# EAGLE design sine wave inverter 1kw(2) (EAGLE 9.6.2)
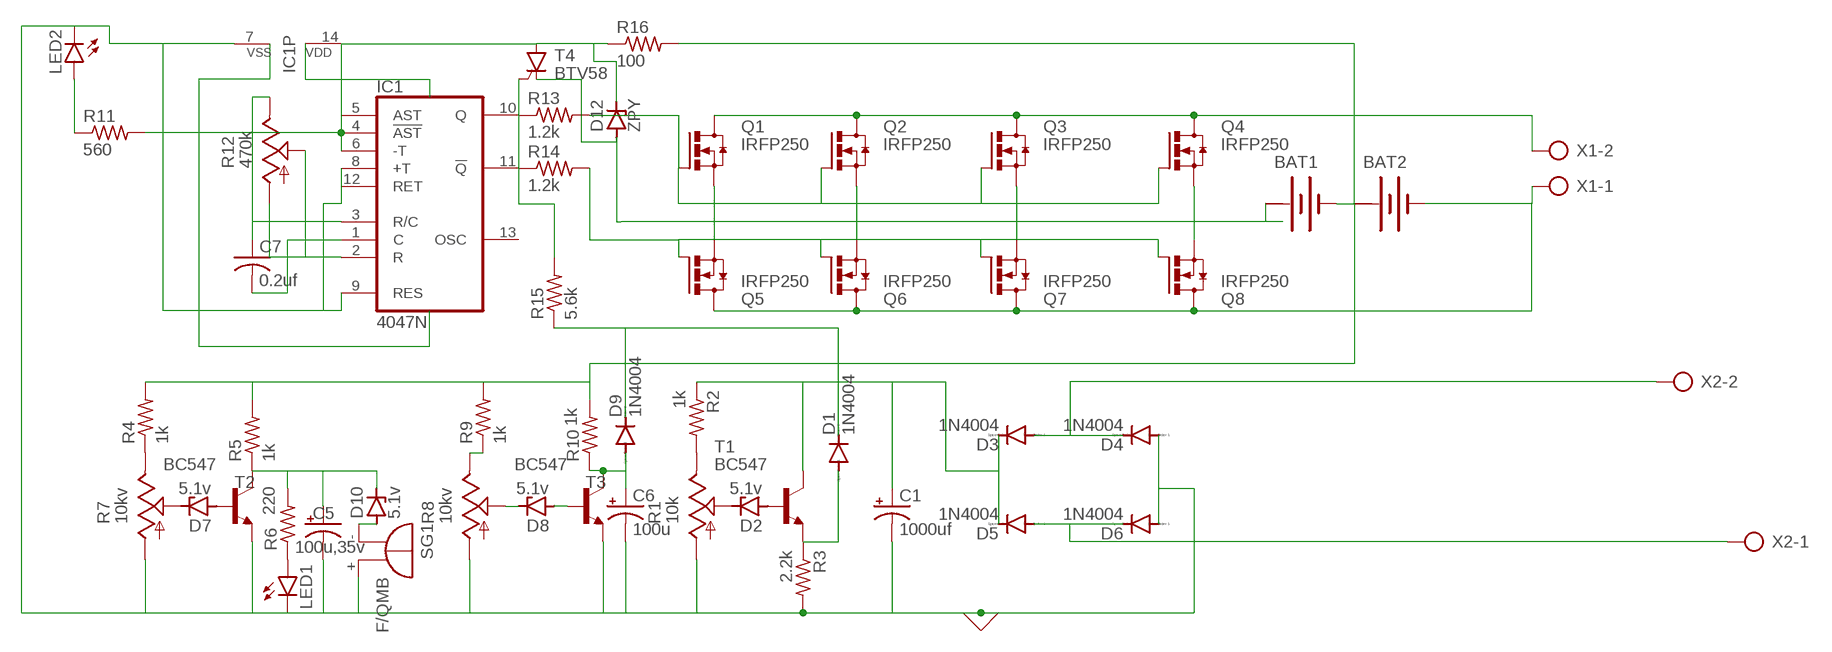
[diagram p0: schematic, sheet 1]

## Parts
BAT1  BATTERY  [BATTERY]
BAT2  BATTERY  [BATTERY]
C1  1000uf  CPOL-USE3.5-10  [E3,5-10]
C5  100u,35v  CPOL-USE3.5-10  [E3,5-10]
C6  100u  CPOL-USE3.5-10  [E3,5-10]
C7  0.2uf  C-US025-024X044  [C025-024X044]
D1  1N4004  [DO41-10]
D2  5.1v  BZX84CSMD  [TO236]
D3  1N4004  [DO41-10]
D4  1N4004  [DO41-10]
D5  1N4004  [DO41-10]
D6  1N4004  [DO41-10]
D7  5.1v  BZX84CSMD  [TO236]
D8  5.1v  BZX84CSMD  [TO236]
D9  1N4004  [DO41-10]
D10  5.1v  BZX84CSMD  [TO236]
D12  ZPY  [DO41Z10]
IC1  4047N  [DIL14]
LED1  LED5MM  [LED5MM]
LED2  LED5MM  [LED5MM]
Q1  IRFP250  [TO-247AD-V]
Q2  IRFP250  [TO-247AD-V]
Q3  IRFP250  [TO-247AD-V]
Q4  IRFP250  [TO-247AD-V]
Q5  IRFP250  [TO-247AD-V]
Q6  IRFP250  [TO-247AD-V]
Q7  IRFP250  [TO-247AD-V]
Q8  IRFP250  [TO-247AD-V]
R1  10k  TRIM_US-B25P  [B25P]
R2  1k  R-US_M1206  [M1206]
R3  2.2k  R-US_M1206  [M1206]
R4  1k  R-US_M1206  [M1206]
R5  1k  R-US_M1206  [M1206]
R6  220  R-US_M1206  [M1206]
R7  10kv  TRIM_US-B25P  [B25P]
R8  10kv  TRIM_US-B25P  [B25P]
R9  1k  R-US_M1206  [M1206]
R10  1k  R-US_M1206  [M1206]
R11  560  R-US_M1206  [M1206]
R12  470k  TRIM_US-B25P  [B25P]
R13  1.2k  R-US_M1206  [M1206]
R14  1.2k  R-US_M1206  [M1206]
R15  5.6k  R-US_M1206  [M1206]
R16  100  R-US_M1206  [M1206]
SG1  F/QMB  [F/QMB]
T1  BC547  [TO92]
T2  BC547  [TO92]
T3  BC547  [TO92]
T4  BTV58  [TO220CS]
X1  AK300/2  [AK300/2]
X2  AK300/2  [AK300/2]

## Nets
0: C1.- C5.- C6.- D4.A D6.A IC1.7(VSS) IC1.8(+T) IC1.9(RES) IC1.12(RET) LED1.K(C) LED2.K(C) R1.A R3.2 R7.A R8.A SG1.+(-) T2.1(E) T3.1(E) ; supply symbol labelled GND
N$1: D2.C R1.S
N$2: R1.E R2.2
N$3: D2.A T1.2(B)
N$4: D1.A R3.1 T1.1(E)
N$5: C1.+ D3.C D5.C R2.1 T1.3(C)
N$6: BAT1.- BAT2.+ R4.2 R5.2 R9.2 R10.2 R16.2
N$7: Q1.G Q2.G Q3.G Q4.G R13.2
N$8: D3.A D4.C X2.2
N$9: Q1.S Q5.S
N$10: D5.A D6.C X2.1
N$11: D7.C R7.S
N$12: Q2.S Q6.S
N$13: Q3.S Q7.S
N$14: Q4.S Q8.S
N$15: Q5.G Q6.G Q7.G Q8.G R14.2
N$17: BAT2.- Q5.D Q6.D Q7.D Q8.D X1.1
N$18: Q1.D Q2.D Q3.D Q4.D X1.2
N$20: D7.A T2.2(B)
N$21: BAT1.+ D12.A T4.C
N$23: C5.+ D10.C R5.1 R6.2 T2.3(C)
N$24: R4.1 R7.E
N$25: LED1.A R6.1
N$26: D1.C D9.C R15.1
N$28: R8.E R9.1
N$29: D8.C R8.S
N$30: D8.A T3.2(B)
N$31: C6.+ D9.A R10.1 T3.3(C)
N$32: D10.A SG1.-(+)
N$33: C7.2 IC1.1(C)
N$35: IC1.2(R) R12.A R12.S
N$36: C7.1 IC1.3(R/C) R12.E
N$37: D12.C IC1.4(!AST) IC1.5(AST) IC1.6(-T) IC1.14(VDD) R11.2 R16.1 T4.A
N$39: IC1.10(Q) R13.1
N$40: IC1.11(!Q) R14.1
N$41: LED2.A R11.1
N$42: R15.2 T4.G
Unconnected: IC1.13(OSC)

## Power pins joined to a net without a drawn wire
+: BAT1.+@1(+) BAT2.+@1(+)

## Library data of the parts
BAT1 BAT2 = special:BATTERY: BATTERY
C1 C5 C6 = rcl:CPOL-US: POLARIZED CAPACITOR, American symbol; SPICEPREFIX: C
C7 = rcl:C-US: CAPACITOR, American symbol; SPICEPREFIX: C
D1 D3-D6 D9 = diode:1N4004: DIODE general purpose rectifier, 1 A
D2 D7 D8 D10 = diode:BZX84CSMD: Z DIODE
D12 = diode:ZPY: Z DIODE 1 W
IC1 = 40xx:4047: LP monostable/astable MULTIVIBRATOR
LED1 LED2 = led:LED: LED OSRAM: - CHIPLED LG R971, LG N971, LY N971, LG Q971, LY Q971, LO R971, LY R971 LH N974, LH R974 LS Q976, LO Q976, LY Q976 LO Q996 - Hyper CHIPLED LW Q18S LB Q993, LB Q99A, LB R99A - SideLED LS A670, LO A670, LY A670, LG A670, LP A670 LB A673, LV A673, LT A673, LW A673 LH A674 LY A675 LS A676, LA A676, LO A676, LY A676, LW A676 LS A679, LY A679, LG A679 - Hyper Micro SIDELED® LS Y876, LA Y876, LO Y876, LY Y876 LT Y87S - SmartLED LW L88C, LW L88S LB L89C, LB L89S, LG L890 LS L89K, LO L89K, LY L89K LS L896, LA L896, LO L896, LY L896 - TOPLED LS T670, LO T670, LY T670, LG T670, LP T670 LSG T670, LSP T670, LSY T670, LOP T670, LYG T670 LG T671, LOG T671, LSG T671 LB T673, LV T673, LT T673, LW T673 LH T674 LS T676, LA T676, LO T676, LY T676, LB T676, LH T676, LSB T676, LW T676 LB T67C, LV T67C, LT T67C, LS T67K, LO T67K, LY T67K, LW E67C LS E67B, LA E67B, LO E67B, LY E67B, LB E67C, LV E67C, LT E67C LW T67C LS T679, LY T679, LG T679 LS T770, LO T770, LY T770, LG T770, LP T770 LB T773, LV T773, LT T773, LW T773 LH T774 LS E675, LA E675, LY E675, LS T675 LS T776, LA T776, LO T776, LY T776, LB T776 LHGB T686 LT T68C, LB T68C - Hyper Mini TOPLED® LB M676 - Mini TOPLED Santana® LG M470 LS M47K, LO M47K, LY M47K Source: http://www.osram.convergy.de LUXEON: - LUMILED® LXK2-PW12-R00, LXK2-PW12-S00, LXK2-PW14-U00, LXK2-PW14-V00 LXK2-PM12-R00, LXK2-PM12-S00, LXK2-PM14-U00 LXK2-PE12-Q00, LXK2-PE12-R00, LXK2-PE12-S00, LXK2-PE14-T00, LXK2-PE14-U00 LXK2-PB12-K00, LXK2-PB12-L00, LXK2-PB12-M00, LXK2-PB14-N00, LXK2-PB14-P00, LXK2-PB14-Q00 LXK2-PR12-L00, LXK2-PR12-M00, LXK2-PR14-Q00, LXK2-PR14-R00 LXK2-PD12-Q00, LXK2-PD12-R00, LXK2-PD12-S00 LXK2-PH12-R00, LXK2-PH12-S00 LXK2-PL12-P00, LXK2-PL12-Q00, LXK2-PL12-R00 Source: www.luxeon.com KINGBRIGHT: KA-3528ASYC Source: www.kingbright.com
Q1-Q8 = transistor-power:IRFP25*: 33A/27A, 200V/150V, 0.085/0.012 Ohm, N-Channel Power MOSFET Source: Fairchild Semiconductor Corporation
R1 R7 R8 R12 = pot:TRIM_US-: POTENTIOMETER
R2-R6 R9-R11 R13-R16 = rcl:R-US_: RESISTOR, American symbol; SPICEPREFIX: R
SG1 = buzzer:F/QMB: BUZZER Source: Buerklin; OC_FARNELL: unknown; OC_NEWARK: unknown
T1-T3 = transistor:BC547: NPN TRANSISTOR
T4 = triac:BTV58: THYRISTOR
X1 X2 = con-ptr500:AK300/2: CONNECTOR; OC_FARNELL: unknown; OC_NEWARK: unknown

## Board
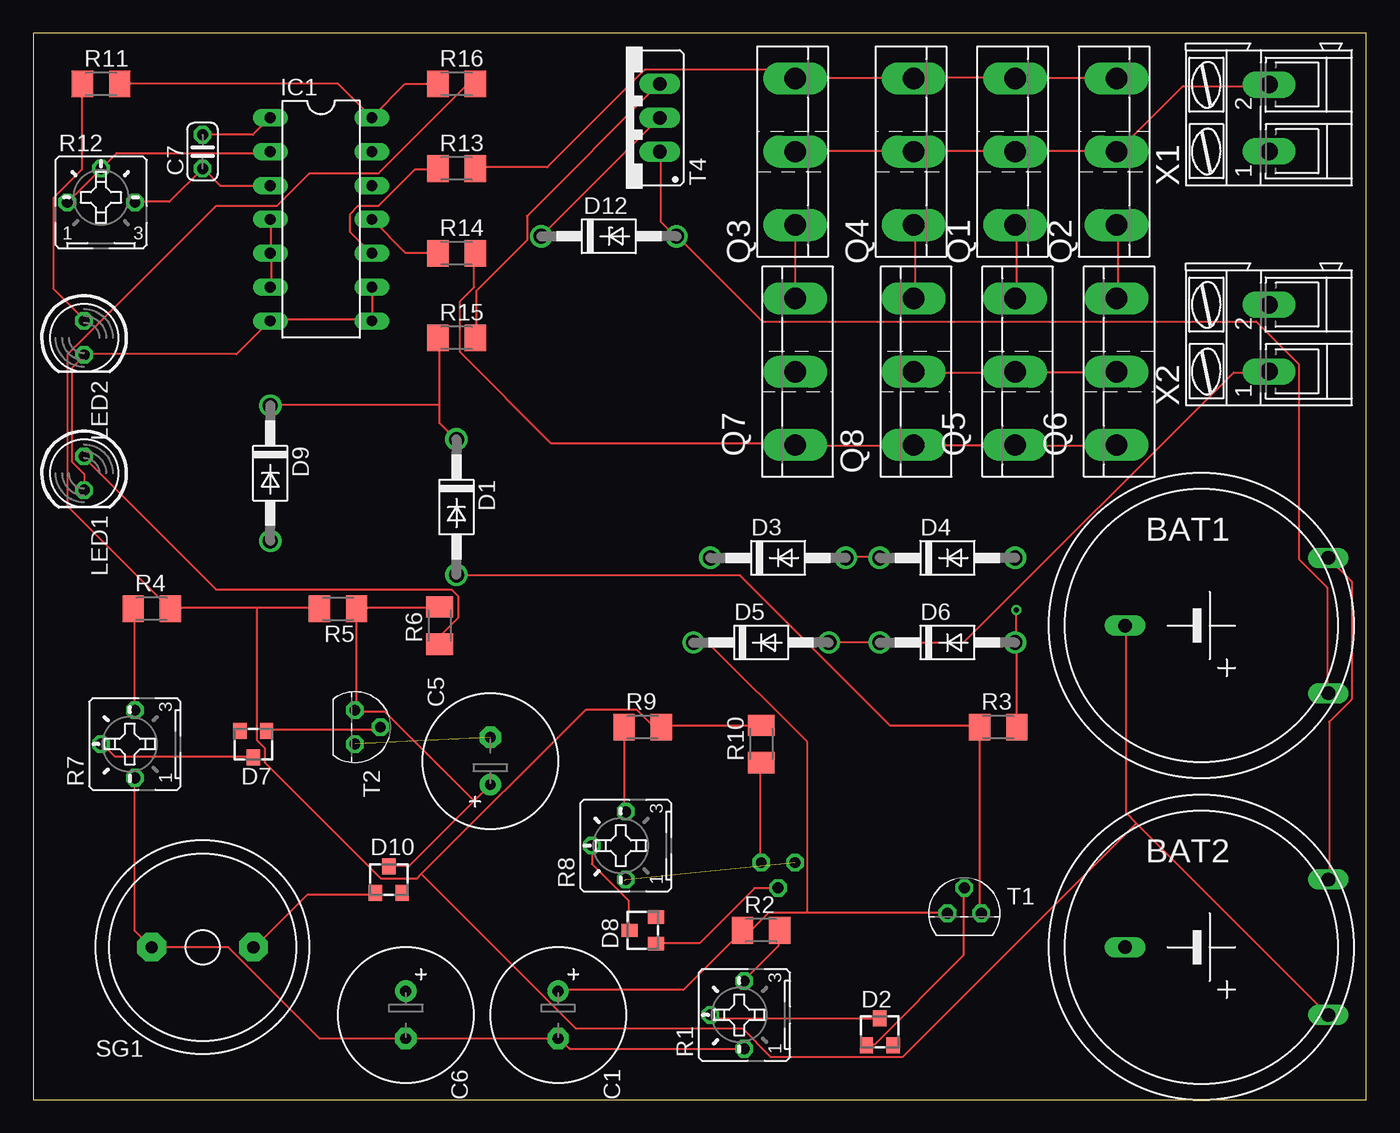
[diagram p1: board, top side]
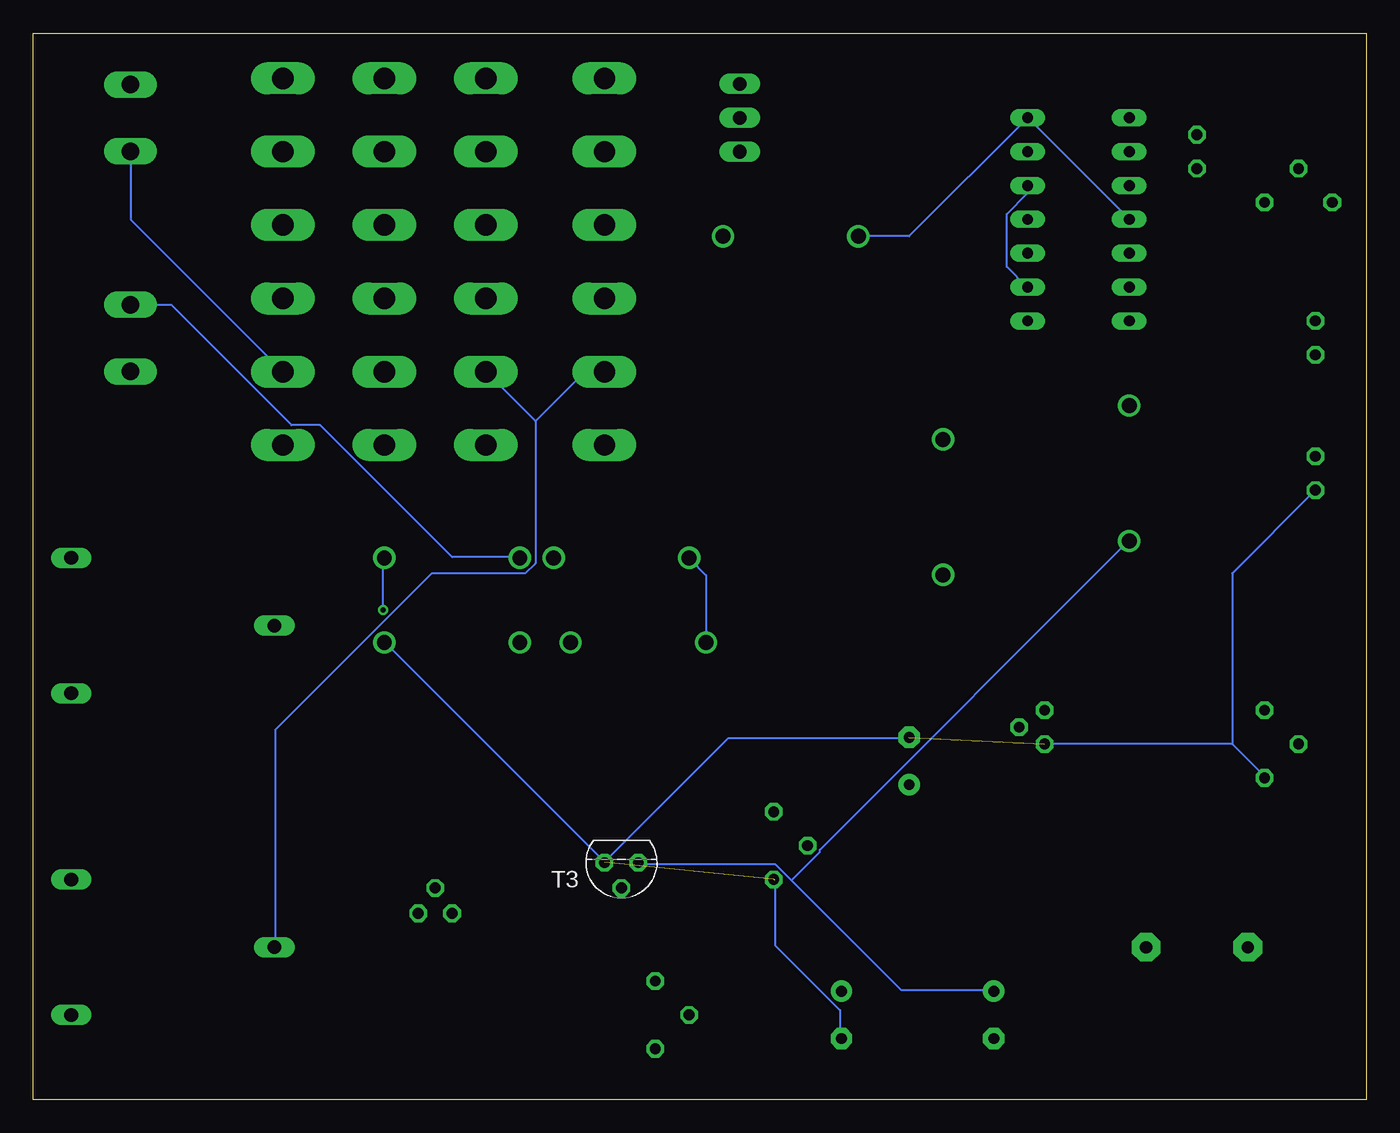
[diagram p2: board, bottom side, seen from below]

Size 100 x 80 mm. Coordinates in mm from the lower left corner, seen from the top.
Outline: 0,0 100,0 100,80 0,80 0,0
Copper layers (1*16): Top 0.035mm / dielectric 1.5mm / Bottom 0.035mm
Design rules "default": minimum track width 6mil, minimum drill 0.35mm, track to track 6mil, track to pad 6mil, pad to pad 6mil, via to via 6mil, smd to smd 6mil, copper to edge 40mil, drill to drill 6mil, minimum pad ring 10mil, minimum via ring 8mil, stop-mask expansion 4mil, vias tented up to drill 0mil, thermal gap 10mil

### Footprints (pad centres in the part's own frame; a part is rotated, then mirrored left to right if it is on the bottom)
BATTERY = drill 1.016 long: + 9.525,-5.08; +@1 9.525,5.08; - -5.715,0
E3,5-10 = drill 0.813 pad 1.6: + -1.778,0 | drill 0.813 pad 1.6 octagon: - 1.778,0
C025-024X044 = drill 0.813 octagon: 1 -1.27,0; 2 1.27,0
DO41-10 = drill 1.118: A 5.08,0; C -5.08,0
TO236 = smd 1 x 1.2: A -1,-1; C 0,1; NC 1,-1
DO41Z10 = drill 1.118: A 5.08,0; C -5.08,0
DIL14 = drill 0.813 long: 1 -7.62,-3.81; 2 -5.08,-3.81; 3 -2.54,-3.81; 4 0,-3.81; 5 2.54,-3.81; 6 5.08,-3.81; 7 7.62,-3.81; 8 7.62,3.81; 9 5.08,3.81; 10 2.54,3.81; 11 0,3.81; 12 -2.54,3.81; 13 -5.08,3.81; 14 -7.62,3.81
LED5MM = drill 0.813 octagon: A -1.27,0; K 1.27,0
TO-247AD-V = drill 1.6 long: D 0,-2.54; G -5.5,-2.54; S 5.5,-2.54
B25P = drill 0.813 octagon: A -2.54,0; E 2.54,0; S 0,2.54
M1206 = smd 1.6 x 2: 1 -1.4,0; 2 1.4,0
F/QMB = drill 0.914 pad 2.159 octagon: + 3.81,0; - -3.81,0
TO92 = drill 0.813 octagon: 1 1.27,0; 2 0,1.905; 3 -1.27,0
TO220CS = drill 1.016 long: A 0,-2.54; C -2.54,-2.54; G 2.54,-2.54
AK300/2 = drill 1.321 long: 1 -2.515,0; 2 2.489,0

### Placement (x,y rotation side)
BAT1  87.63,35.56 0 top
BAT2  87.63,11.43 0 top
C1  39.37,6.35 270 top
C5  34.29,25.4 90 top
C6  27.94,6.35 270 top
C7  12.7,71.12 90 top
D1  31.75,44.45 270 top
D2  63.5,5.08 0 top
D3  55.88,40.64 0 top
D4  68.58,40.64 0 top
D5  54.61,34.29 0 top
D6  68.58,34.29 0 top
D7  16.51,26.67 180 top
D8  45.72,12.7 90 top
D9  17.78,46.99 270 top
D10  26.67,16.51 0 top
D12  43.18,64.77 0 top
IC1  21.59,66.04 270 top
LED1  3.81,46.99 270 top
LED2  3.81,57.15 270 top
Q1  76.2,71.12 270 top
Q2  83.82,71.12 270 top
Q3  59.69,71.12 270 top
Q4  68.58,71.12 270 top
Q5  71.12,54.61 90 top
Q6  78.74,54.61 90 top
Q7  54.61,54.61 90 top
Q8  63.5,54.61 90 top
R1  53.34,6.35 90 top
R2  54.61,12.7 0 top
R3  72.39,27.94 0 top
R4  8.89,36.83 0 top
R5  22.86,36.83 180 top
R6  30.48,35.56 90 top
R7  7.62,26.67 90 top
R8  44.45,19.05 90 top
R9  45.72,27.94 0 top
R10  54.61,26.67 90 top
R11  5.08,76.2 0 top
R12  5.08,67.31 0 top
R13  31.75,69.85 0 top
R14  31.75,63.5 0 top
R15  31.75,57.15 0 top
R16  31.75,76.2 0 top
SG1  12.7,11.43 180 top
T1  69.85,13.97 0 top
T2  24.13,27.94 270 top
T3  55.88,17.78 180 bottom
T4  44.45,73.66 90 top
X1  92.71,73.66 90 top
X2  92.71,57.15 90 top

### Tracks (layer width: path | path; a pad name or v marks a point on that pad's centre or on a via)
0  (via drill 0.35)  (3 unrouted)
  Top 0.152: R7.A 7.62,12.65 8.84,11.43 SG1.+ 14.63,11.43 21.49,4.57 C6.- C1.- 39.47,4.57 40.23,3.81 R1.A | LED1.K 3.81,46.94 2.9,47.85 2.9,54.86 3.81,55.78 LED2.K 3.81,55.93 15.24,55.93 17.68,58.37 IC1.7 17.83,58.52 25.3,58.52 IC1.8 25.45,58.52 25.45,60.96 IC1.9 | 73.76,34.29 73.76,28.04 R3.2 | 73.76,34.29 v73.76,36.73 | 73.76,34.29 D6.A
  Bottom 0.152: 10.06,26.67 T2.1 | 10.06,26.67 7.62,24.23 R7.A | IC1.12 25.45,68.58 25.45,67.97 26.98,66.45 26.98,62.48 25.45,60.96 IC1.9 | 10.06,26.67 10.06,39.47 LED1.K | v73.76,36.73 73.76,40.54 D4.A | C5.- 34.29,27.13 47.85,27.13 57.15,17.83 73.61,34.29 D6.A | 44.35,16.46 44.35,11.58 39.47,6.71 39.47,4.57 C1.-
+
  Top 0.152: BAT2.+@1 97.23,16.61 97.23,28.35 98.91,30.02 98.91,38.86 97.23,40.54 BAT1.+@1
N$1
  Top 0.152: R1.S 51.05,6.1 63.4,6.1 D2.C
N$2
  Top 0.152: R2.2 55.93,12.65 55.93,11.58 53.34,8.99 R1.E
N$3
  Top 0.152: D2.A 62.64,4.12 63.09,4.12 69.8,10.82 69.8,15.85 T1.2
N$4
  Top 0.152: T1.1 71.02,14.02 71.02,27.89 R3.1 70.87,28.04 64.31,28.04 53.03,39.32 31.85,39.32 D1.A
N$5
  Top 0.152: 58.06,14.02 68.58,14.02 T1.3 | 58.06,14.02 55.17,14.02 53.95,12.8 53.34,12.8 R2.1 53.19,12.65 48.77,8.23 39.47,8.23 C1.+ | D5.C 50.6,34.29 58.06,26.82 58.06,14.02
  Bottom 0.152: D5.C 49.53,39.32 50.75,40.54 D3.C
N$6
  Top 0.152: 82.75,20.73 97.08,6.4 BAT2.+ | 82.75,20.73 81.99,21.49 81.99,35.51 BAT1.- | R10.2 54.56,28.04 47.24,28.04 R9.2 47.09,28.04 46.48,28.04 45.26,29.26 41.45,29.26 29.11,16.92 | 16.76,36.88 21.34,36.88 R5.2 | 16.76,36.88 10.36,36.88 R4.2 10.21,36.88 2.59,44.5 2.59,55.93 13.72,67.06 18.29,67.06 20.73,69.49 25.91,69.49 32.61,76.2 R16.2 | 29.11,16.92 28.8,16.61 26.06,16.61 17.37,25.3 17.37,26.36 16.76,26.98 16.76,36.88 | 82.75,20.73 65.23,3.2 55.32,3.2 53.19,5.33 40.69,5.33 29.11,16.92
N$7
  Top 0.152: Q2.G 81.23,76.66 73.76,76.66 Q1.G 73.61,76.66 66.14,76.66 Q4.G 65.99,76.66 57.15,76.66 | 57.15,76.66 56.54,77.27 45.87,77.27 38.56,69.95 33.22,69.95 R13.2 | 57.15,76.66 Q3.G
N$8
  Top 0.152: D3.A 60.96,40.69 63.4,40.69 D4.C
  Bottom 0.152: X2.2 92.66,59.59 89.61,59.59 80.62,50.6 78.49,50.6 68.58,40.69 63.55,40.69 D4.C
N$9
  Top 0.152: Q5.S 73.76,60.2 73.76,65.53 Q1.S
N$10
  Top 0.152: D5.A D6.C 69.8,34.29 90.07,54.56 92.66,54.56 X2.1
N$11
  Top 0.152: D7.C 16.46,25.76 6.1,25.76 5.18,26.67 R7.S
N$12
  Top 0.152: Q6.S 81.38,60.2 81.38,65.53 Q2.S
N$13
  Top 0.152: Q3.S Q7.S
N$14
  Top 0.152: Q8.S 66.14,60.2 66.14,65.53 Q4.S
N$15
  Top 0.152: Q6.G 81.23,49.07 73.76,49.07 Q5.G 73.61,49.07 66.14,49.07 Q8.G 65.99,49.07 57.15,49.07 Q7.G 57.15,49.23 38.86,49.23 32,56.08 32,59.89 33.07,60.96 33.07,63.4 R14.2
N$17
  Top 0.152: Q6.D 81.23,54.56 73.76,54.56 Q5.D 73.61,54.56 66.14,54.56 Q8.D
  Bottom 0.152: Q6.D 92.66,65.99 92.66,71.02 X1.1 | 62.33,50.9 62.33,40.23 63.09,39.47 70.1,39.47 81.84,27.74 81.84,11.43 BAT2.- | Q8.D 62.33,50.9 | 62.33,50.9 58.67,54.56 57.15,54.56 Q7.D
N$18
  Top 0.152: Q3.D 57.15,71.17 65.99,71.17 Q4.D 66.14,71.17 73.61,71.17 Q1.D 73.76,71.17 81.23,71.17 Q2.D 81.38,71.17 86.26,76.05 92.66,76.05 X1.2
N$20
  Top 0.152: D7.A 17.53,27.74 25.76,27.74 25.91,27.89 T2.2
N$21
  Top 0.152: T4.C 47.09,71.02 47.09,65.84 48.16,64.77 D12.A 48.31,64.77 54.71,58.37 91.75,58.37 94.94,55.17 94.94,40.54 97.08,38.41 97.08,30.48 BAT1.+
N$23
  Top 0.152: C5.+ 33.07,22.4 | 33.07,22.4 28.19,17.53 26.67,17.53 D10.C | R6.2 30.48,36.88 24.38,36.88 R5.1 24.23,36.73 24.23,29.26 T2.3 24.23,29.11 26.36,29.11 33.07,22.4
N$24
  Top 0.152: R7.E 7.62,36.73 R4.1
N$25
  Top 0.152: R6.1 30.48,34.75 31.85,36.12 31.85,37.8 31.39,38.25 13.72,38.25 3.81,48.16 LED1.A
N$26
  Top 0.152: 30.48,52.12 30.48,50.75 31.7,49.53 D1.C | 30.48,52.12 30.48,57.15 R15.1 | 30.48,52.12 17.83,52.12 D9.C
N$28
  Top 0.152: R9.1 44.35,27.89 44.35,21.64 R8.E
N$29
  Top 0.152: R8.S 41.91,17.68 44.65,14.94 44.65,12.8 D8.C
N$30
  Top 0.152: D8.A 46.79,11.73 49.99,11.73 54.1,15.85 55.78,15.85 T3.2
N$31
  Top 0.152: R10.1 54.56,25.15 54.56,17.83 T3.3
  Bottom 0.152: 43.13,16.46 44.35,17.68 54.56,17.68 T3.3 | 43.13,16.46 34.9,8.23 28.04,8.23 C6.+ | 43.13,16.46 41,18.59 41,18.75 17.83,41.91 D9.A
N$32
  Top 0.152: D10.A 25.6,15.39 20.57,15.39 16.61,11.43 SG1.-
N$33
  Top 0.152: C7.2 16.46,72.39 17.68,73.61 IC1.1
N$35
  Top 0.152: R12.A R12.S 6.25,71.02 17.68,71.02 IC1.2
N$36
  Top 0.152: R12.E 7.62,67.36 10.21,67.36 C7.1 12.8,69.8 14.02,68.58 IC1.3
N$37
  Top 0.152: D12.C T4.A | IC1.6 17.83,60.96 17.83,63.4 IC1.5 17.83,63.55 17.83,65.99 IC1.4 | R11.2 22.86,76.2 IC1.14 25.45,73.76 27.89,76.2 R16.1
  Bottom 0.152: IC1.4 17.83,66.14 25.3,73.61 IC1.14 34.29,64.77 D12.C
N$39
  Top 0.152: R13.1 30.33,69.8 28.65,69.8 25.91,67.06 24.38,67.06 23.77,66.45 23.77,65.08 25.3,63.55 IC1.10
N$40
  Top 0.152: IC1.11 27.89,63.55 30.33,63.55 R14.1
N$41
  Top 0.152: R11.1 3.66,76.2 3.66,69.8 1.52,67.67 1.52,60.81 3.81,58.52 LED2.A
N$42
  Top 0.152: R15.2 33.22,57.15 33.22,60.66 37.03,64.47 37.03,66.29 46.94,76.2 T4.G